# EAGLE schematic ESP8266-Bootloader-01 (EAGLE 7.7.0)
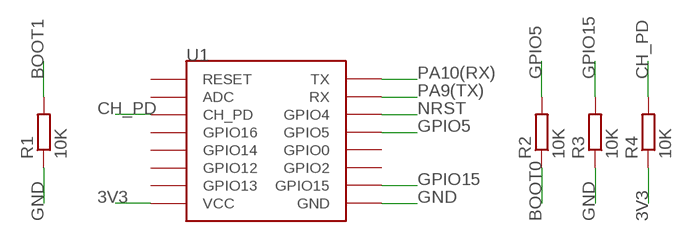
[diagram p0: schematic, sheet 1]

## Parts
R1  10K  R-EU_R0603  [R0603]
R2  10K  R-EU_R0603  [R0603]
R3  10K  R-EU_R0603  [R0603]
R4  10K  R-EU_R0603  [R0603]
U1  ESP12  [ESP12]

## Nets
3V3: R4.1 U1.VCC
BOOT0: R2.1
BOOT1: R1.2
CH_PD: R4.2 U1.CH_PD
GND: R1.1 R3.1 U1.GND
GPIO5: R2.2 U1.GPIO5
GPIO15: R3.2 U1.GPIO15
NRST: U1.GPIO4
PA9(TX): U1.RX
PA10(RX): U1.TX
Unconnected: U1.ADC U1.GPIO0 U1.GPIO2 U1.GPIO12 U1.GPIO13 U1.GPIO14 U1.GPIO16 U1.RESET

## Library data of the parts
R1-R4 = rcl:R-EU_: RESISTOR, European symbol
U1 = esp8266modules:ESP12: ESP8266 Wifi module 12